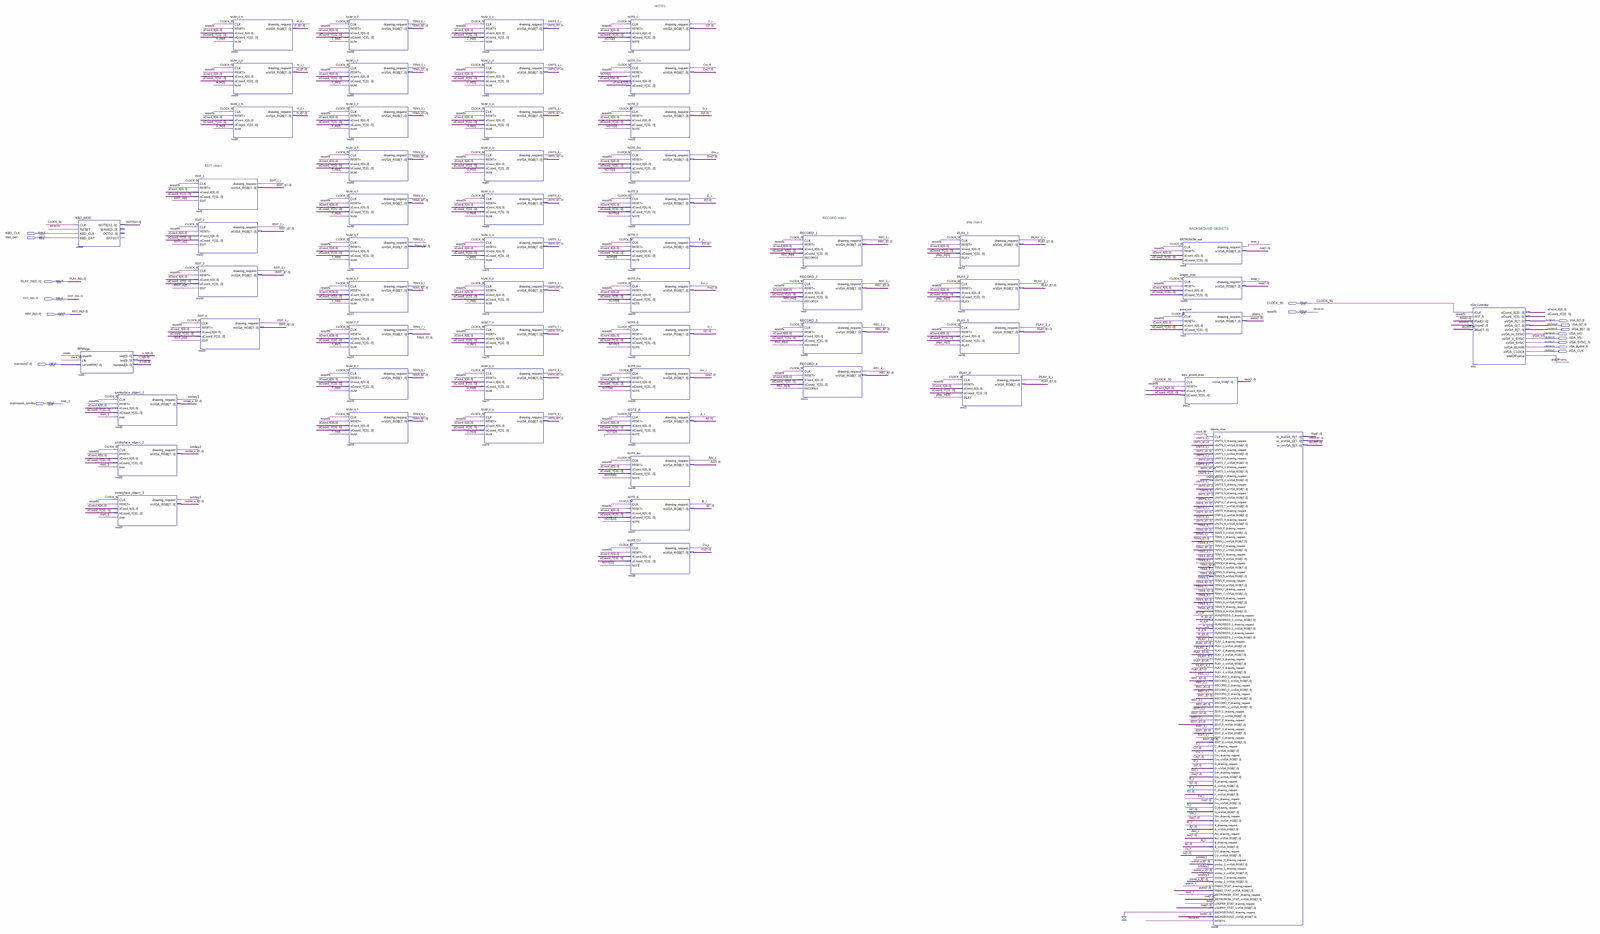
[diagram p0: schematic sheet, whole]
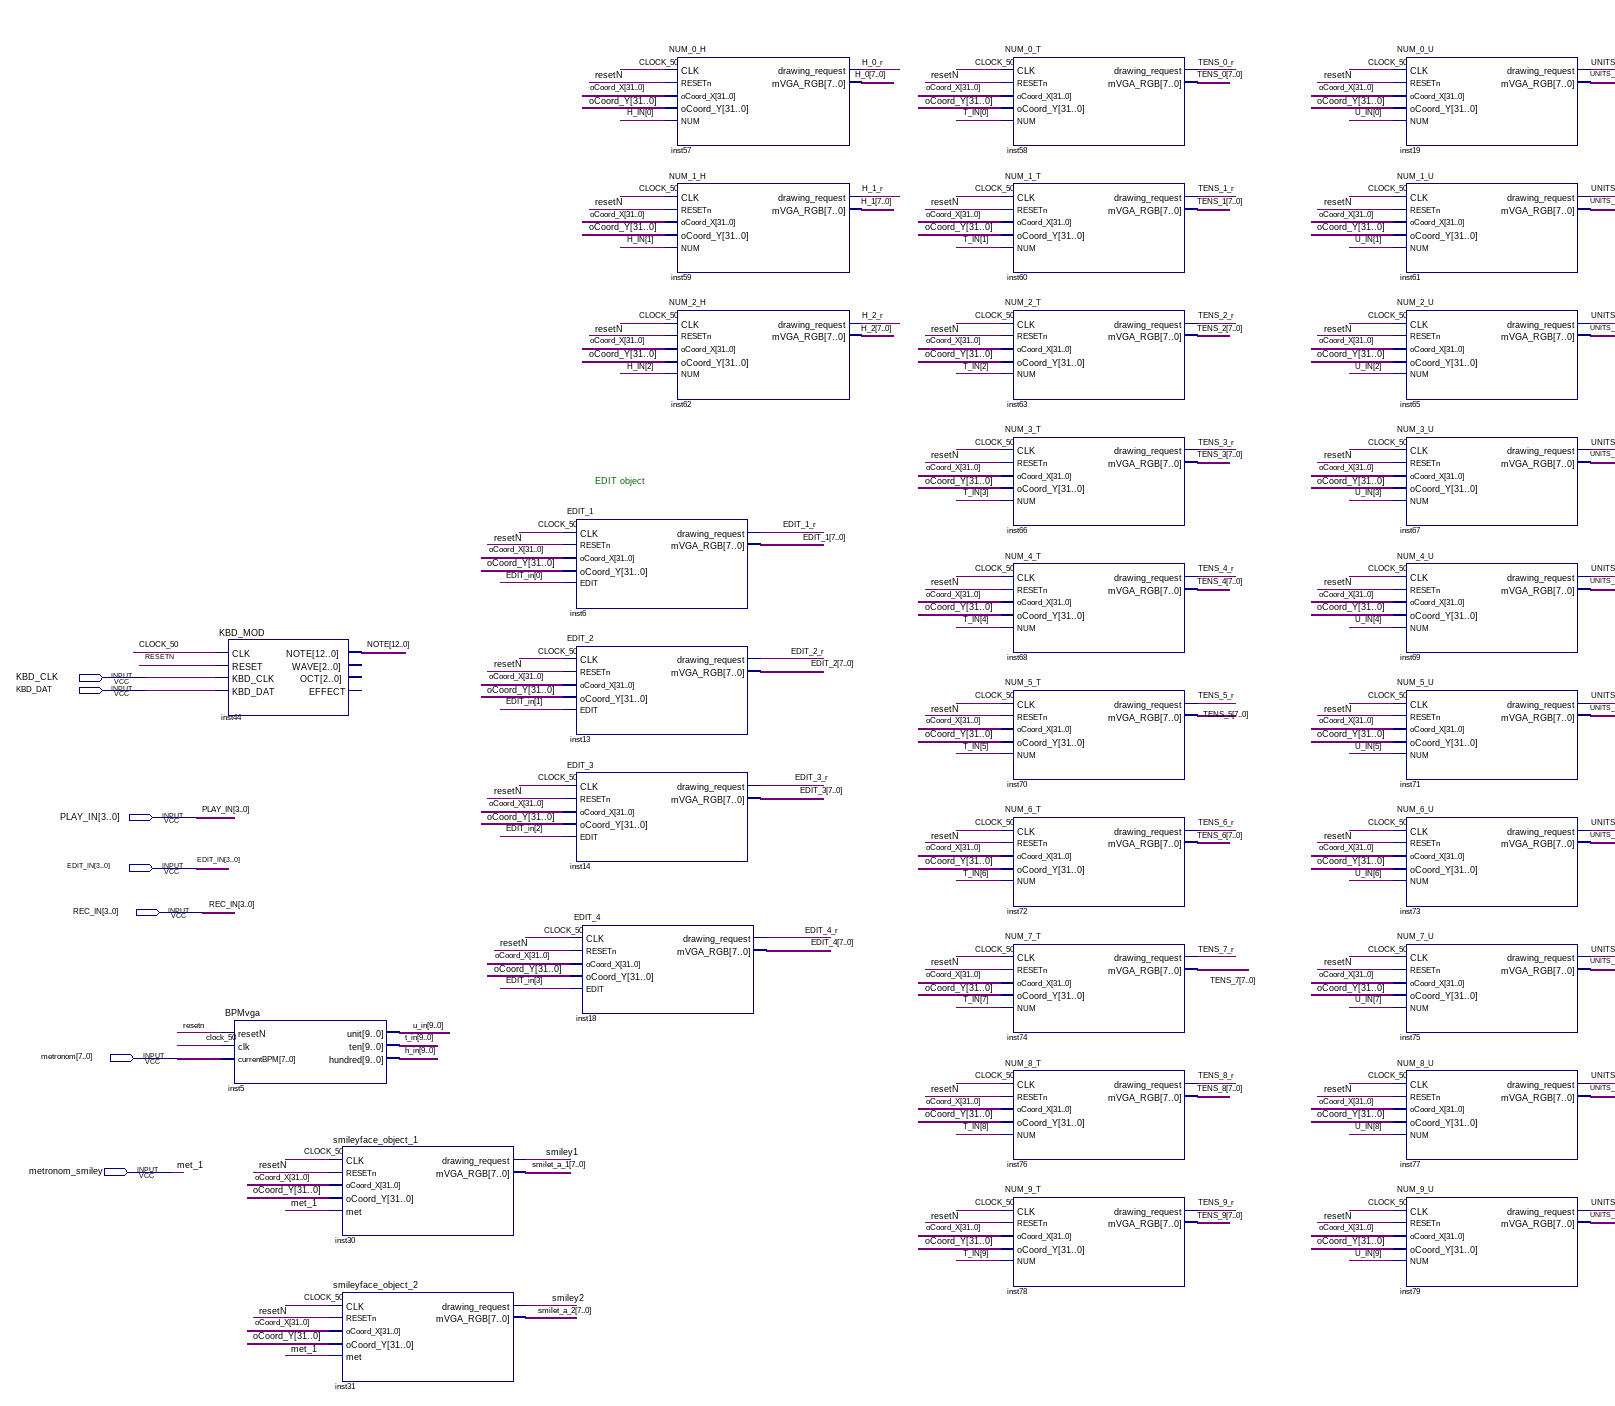
[diagram p1: schematic sheet, upper left part]
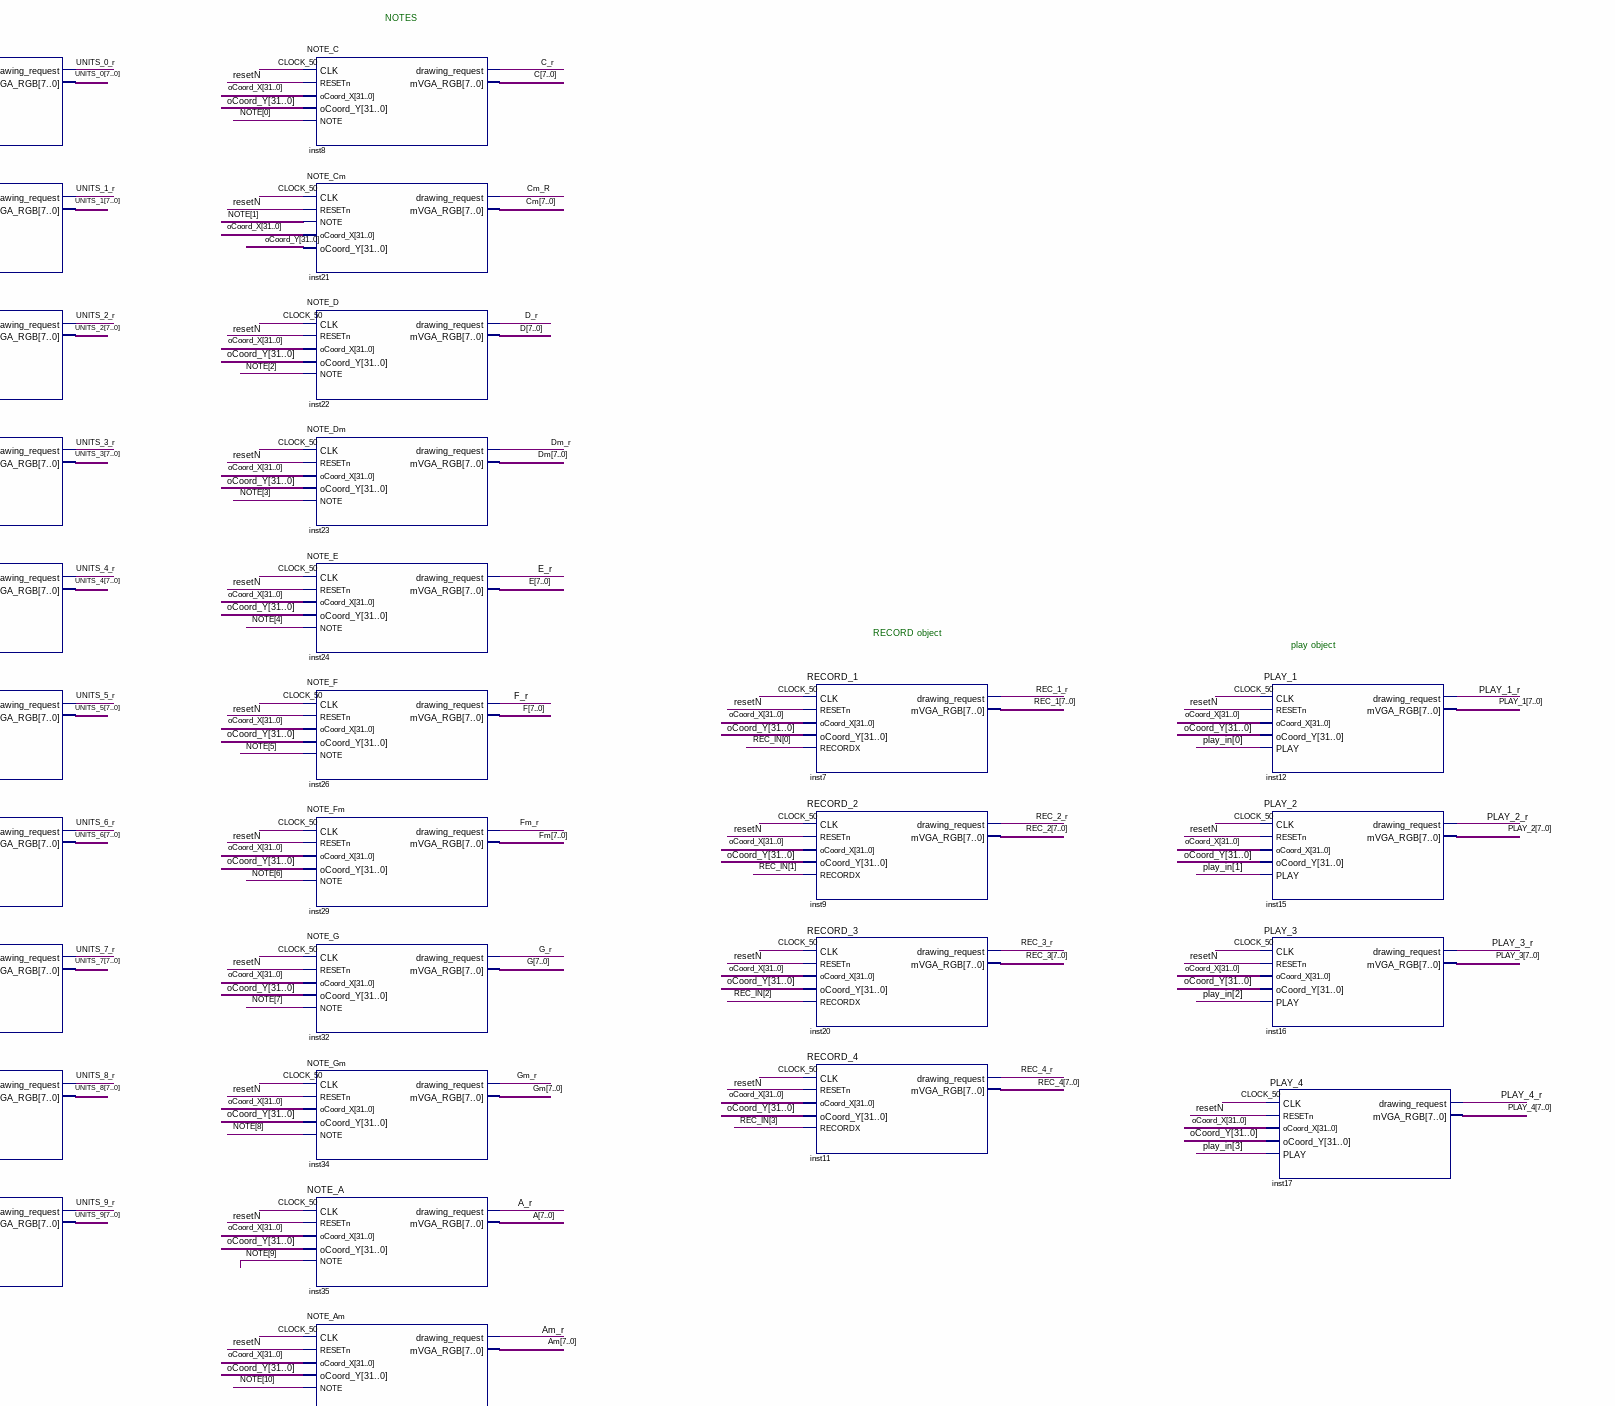
[diagram p2: schematic sheet, upper centre part]
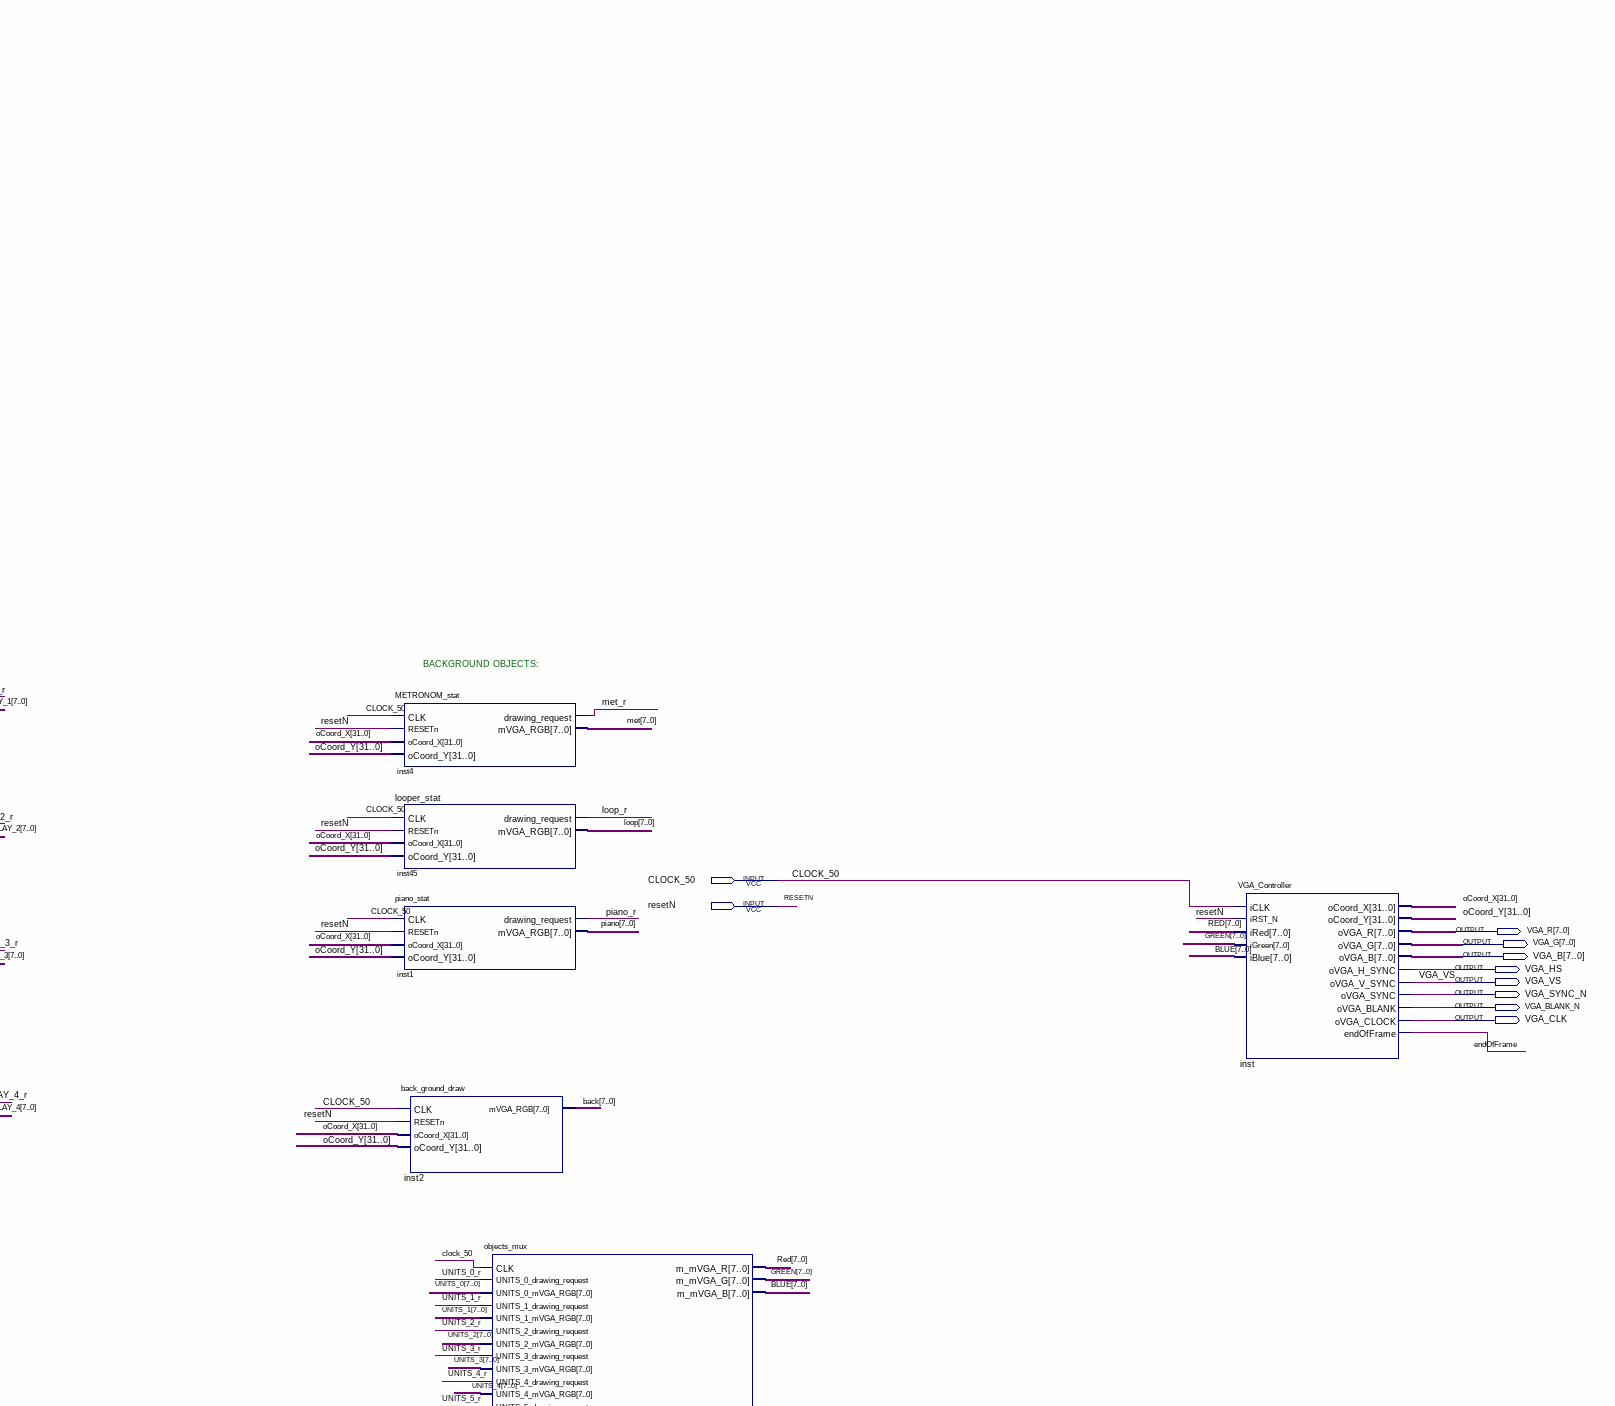
[diagram p3: schematic sheet, upper right part]
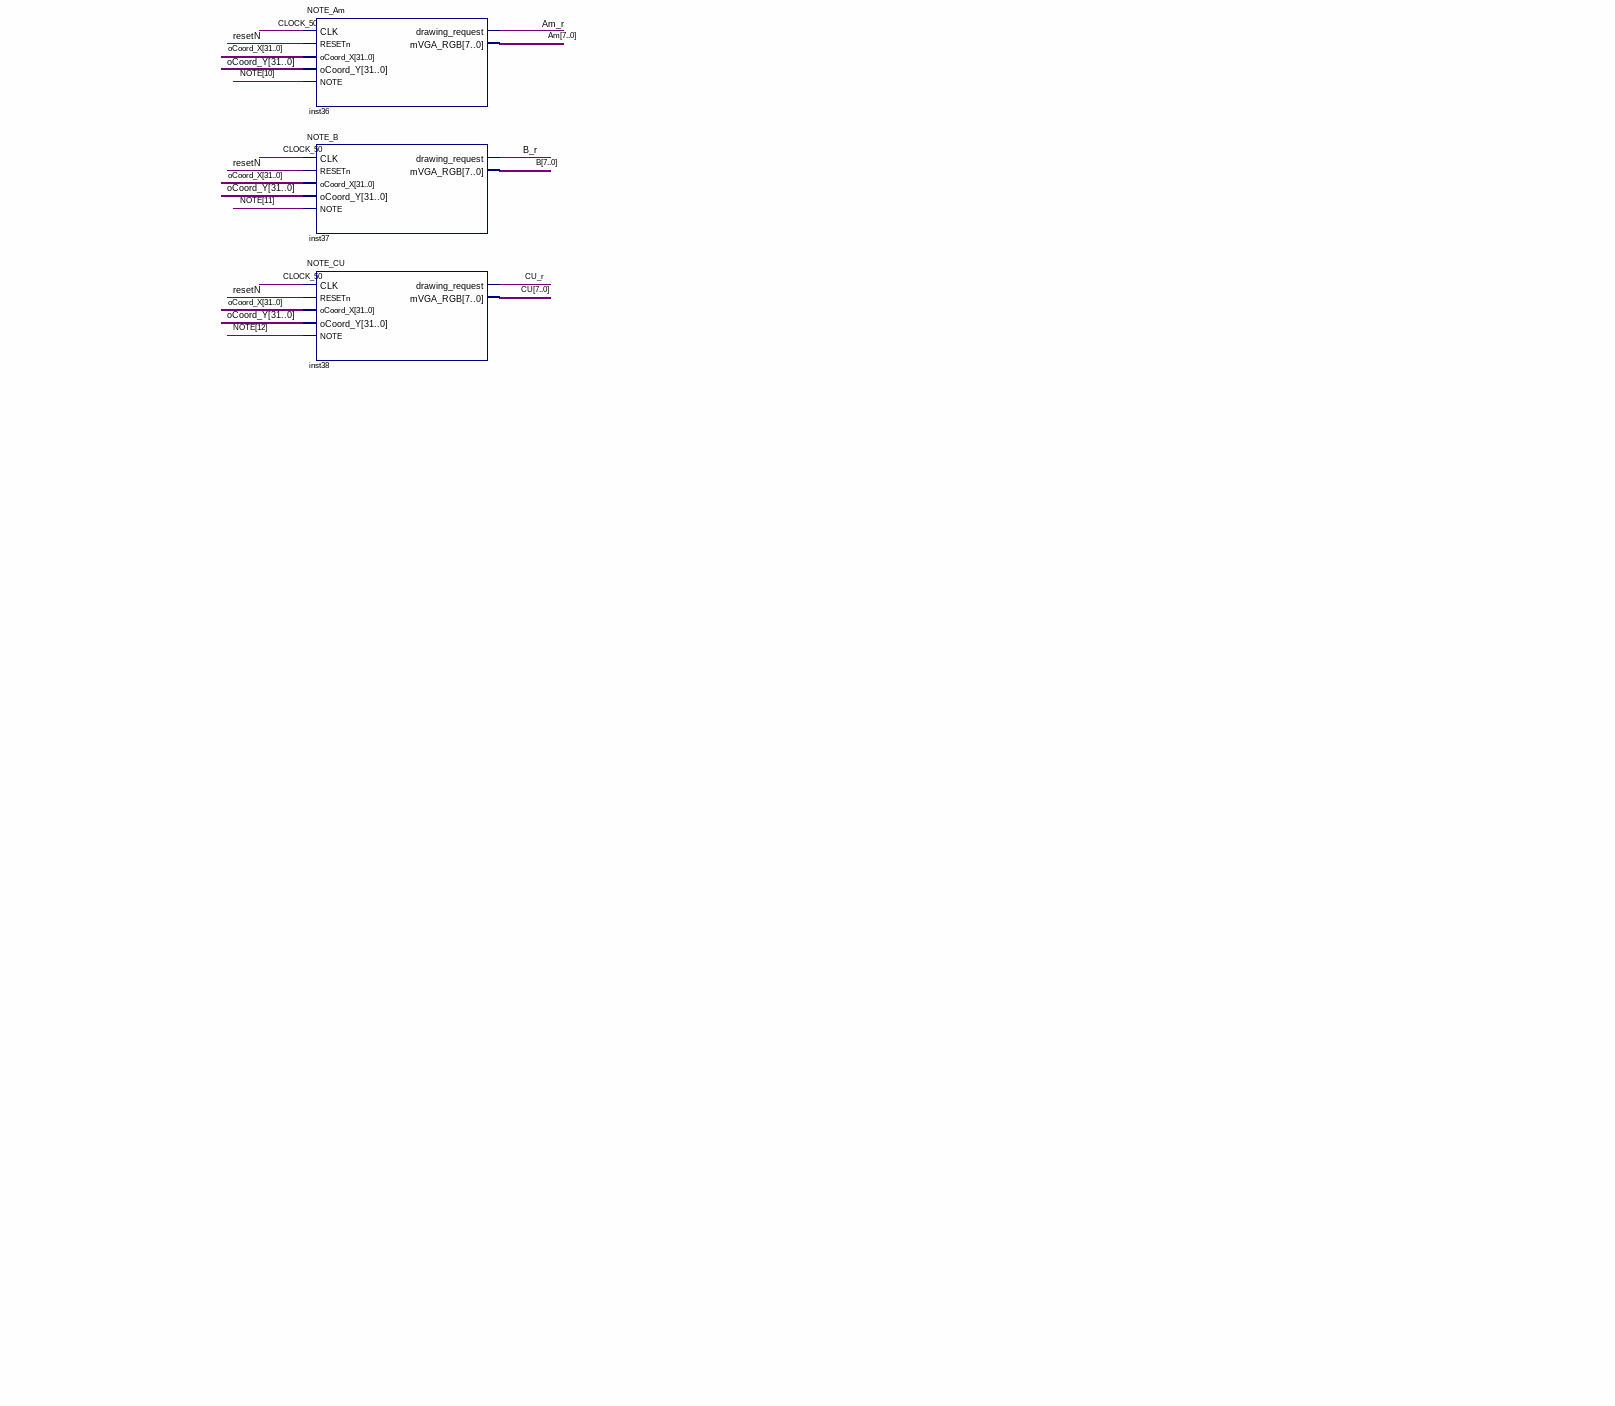
[diagram p4: schematic sheet, lower centre part]
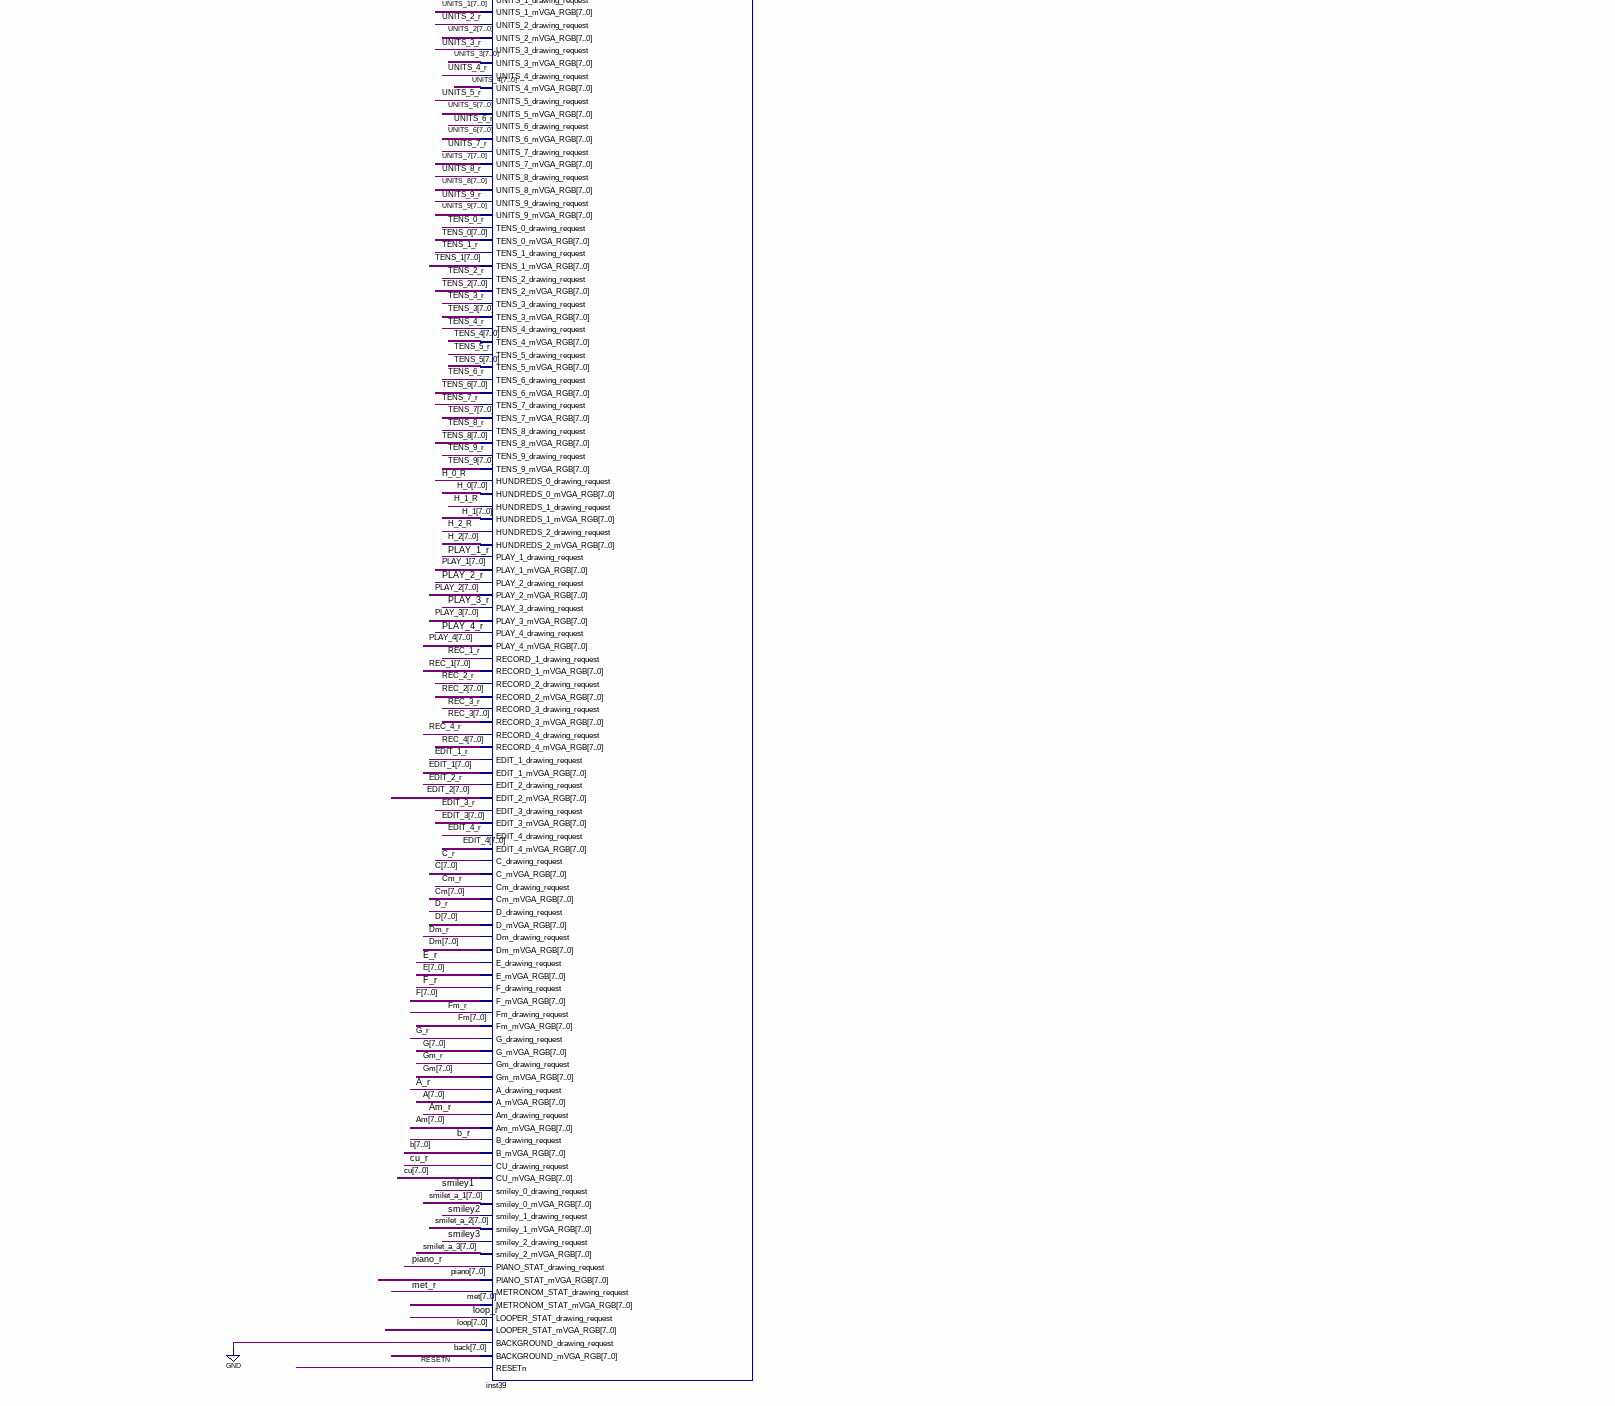
[diagram p5: schematic sheet, lower right part]
// Quartus schematic TOP_SIFTACH.bdf as structural Verilog: 59 symbols, 17 pins
module TOP_SIFTACH (
  input  KBD_CLK,
  input  KBD_DAT,
  input  [3:0] PLAY_IN,
  input  [3:0] EDIT_IN,
  input  CLOCK_50,
  input  resetN,
  input  [3:0] REC_IN,
  input  [7:0] metronom,
  input  metronom_smiley,
  output [7:0] VGA_R,
  output [7:0] VGA_G,
  output [7:0] VGA_B,
  output VGA_HS,
  output VGA_VS,
  output VGA_SYNC_N,
  output VGA_BLANK_N,
  output VGA_CLK
);

  wire A_r, Am_r, B_r, C_r, Cm_R, CU_r, D_r, Dm_r, E_r, EDIT_1_r, EDIT_2_r, EDIT_3_r, EDIT_4_r, endOfFrame,
       F_r, Fm_r, G_r, Gm_r, H_0_R, H_1_R, H_2_R, loop_r, met_r, piano_r, PLAY_1_r, PLAY_2_r, PLAY_3_r,
       PLAY_4_r, REC_1_r, REC_2_r, REC_3_r, REC_4_r, smiley1, smiley2, smiley3, TENS_0_r, TENS_1_r, TENS_2_r,
       TENS_3_r, TENS_4_r, TENS_5_r, TENS_6_r, TENS_7_r, TENS_8_r, TENS_9_r, UNITS_0_r, UNITS_1_r, UNITS_2_r,
       UNITS_3_r, UNITS_4_r, UNITS_5_r, UNITS_6_r, UNITS_7_r, UNITS_8_r, UNITS_9_r;
  wire [7:0] A, Am, B, back, BLUE, C, Cm, CU, D, Dm, E, EDIT_1, EDIT_2, EDIT_3, EDIT_4, F, Fm, G, Gm, GREEN,
       H_0, H_1, H_2, loop, met, piano, PLAY_1, PLAY_2, PLAY_3, PLAY_4, REC_1, REC_2, REC_3, REC_4, RED,
       smilet_a_1, smilet_a_2, smilet_a_3, TENS_0, TENS_1, TENS_2, TENS_3, TENS_4, TENS_5, TENS_6, TENS_7,
       TENS_8, TENS_9, UNITS_0, UNITS_1, UNITS_2, UNITS_3, UNITS_4, UNITS_5, UNITS_6, UNITS_7, UNITS_8,
       UNITS_9;
  wire [9:0] H_IN, T_IN, U_IN;
  wire [12:0] NOTE;
  wire [31:0] oCoord_X, oCoord_Y;

  KBD_MOD inst44 (
    .CLK(CLOCK_50), .RESET(resetN), .KBD_CLK(KBD_CLK), .KBD_DAT(KBD_DAT), .NOTE(NOTE));  // open: WAVE, OCT, EFFECT
  BPMvga inst5 (.resetN(resetN), .clk(CLOCK_50), .currentBPM(metronom), .unit(U_IN), .ten(T_IN), .hundred(H_IN));
  smileyface_object_1 inst30 (
    .CLK(CLOCK_50), .RESETn(resetN), .oCoord_X(oCoord_X), .oCoord_Y(oCoord_Y), .met(metronom_smiley),
    .drawing_request(smiley1), .mVGA_RGB(smilet_a_1));
  smileyface_object_2 inst31 (
    .CLK(CLOCK_50), .RESETn(resetN), .oCoord_X(oCoord_X), .oCoord_Y(oCoord_Y), .met(metronom_smiley),
    .drawing_request(smiley2), .mVGA_RGB(smilet_a_2));
  smileyface_object_3 inst33 (
    .CLK(CLOCK_50), .RESETn(resetN), .oCoord_X(oCoord_X), .oCoord_Y(oCoord_Y), .met(metronom_smiley),
    .drawing_request(smiley3), .mVGA_RGB(smilet_a_3));
  EDIT_1 inst6 (
    .CLK(CLOCK_50), .RESETn(resetN), .oCoord_X(oCoord_X), .oCoord_Y(oCoord_Y), .EDIT(EDIT_IN[0]),
    .drawing_request(EDIT_1_r), .mVGA_RGB(EDIT_1));
  EDIT_2 inst13 (
    .CLK(CLOCK_50), .RESETn(resetN), .oCoord_X(oCoord_X), .oCoord_Y(oCoord_Y), .EDIT(EDIT_IN[1]),
    .drawing_request(EDIT_2_r), .mVGA_RGB(EDIT_2));
  EDIT_3 inst14 (
    .CLK(CLOCK_50), .RESETn(resetN), .oCoord_X(oCoord_X), .oCoord_Y(oCoord_Y), .EDIT(EDIT_IN[2]),
    .drawing_request(EDIT_3_r), .mVGA_RGB(EDIT_3));
  EDIT_4 inst18 (
    .CLK(CLOCK_50), .RESETn(resetN), .oCoord_X(oCoord_X), .oCoord_Y(oCoord_Y), .EDIT(EDIT_IN[3]),
    .drawing_request(EDIT_4_r), .mVGA_RGB(EDIT_4));
  NUM_0_H inst57 (
    .CLK(CLOCK_50), .RESETn(resetN), .oCoord_X(oCoord_X), .oCoord_Y(oCoord_Y), .NUM(H_IN[0]),
    .drawing_request(H_0_R), .mVGA_RGB(H_0));
  NUM_1_H inst59 (
    .CLK(CLOCK_50), .RESETn(resetN), .oCoord_X(oCoord_X), .oCoord_Y(oCoord_Y), .NUM(H_IN[1]),
    .drawing_request(H_1_R), .mVGA_RGB(H_1));
  NUM_2_H inst62 (
    .CLK(CLOCK_50), .RESETn(resetN), .oCoord_X(oCoord_X), .oCoord_Y(oCoord_Y), .NUM(H_IN[2]),
    .drawing_request(H_2_R), .mVGA_RGB(H_2));
  NUM_0_T inst58 (
    .CLK(CLOCK_50), .RESETn(resetN), .oCoord_X(oCoord_X), .oCoord_Y(oCoord_Y), .NUM(T_IN[0]),
    .drawing_request(TENS_0_r), .mVGA_RGB(TENS_0));
  NUM_1_T inst60 (
    .CLK(CLOCK_50), .RESETn(resetN), .oCoord_X(oCoord_X), .oCoord_Y(oCoord_Y), .NUM(T_IN[1]),
    .drawing_request(TENS_1_r), .mVGA_RGB(TENS_1));
  NUM_2_T inst63 (
    .CLK(CLOCK_50), .RESETn(resetN), .oCoord_X(oCoord_X), .oCoord_Y(oCoord_Y), .NUM(T_IN[2]),
    .drawing_request(TENS_2_r), .mVGA_RGB(TENS_2));
  NUM_3_T inst66 (
    .CLK(CLOCK_50), .RESETn(resetN), .oCoord_X(oCoord_X), .oCoord_Y(oCoord_Y), .NUM(T_IN[3]),
    .drawing_request(TENS_3_r), .mVGA_RGB(TENS_3));
  NUM_4_T inst68 (
    .CLK(CLOCK_50), .RESETn(resetN), .oCoord_X(oCoord_X), .oCoord_Y(oCoord_Y), .NUM(T_IN[4]),
    .drawing_request(TENS_4_r), .mVGA_RGB(TENS_4));
  NUM_5_T inst70 (
    .CLK(CLOCK_50), .RESETn(resetN), .oCoord_X(oCoord_X), .oCoord_Y(oCoord_Y), .NUM(T_IN[5]),
    .drawing_request(TENS_5_r), .mVGA_RGB(TENS_5));
  NUM_6_T inst72 (
    .CLK(CLOCK_50), .RESETn(resetN), .oCoord_X(oCoord_X), .oCoord_Y(oCoord_Y), .NUM(T_IN[6]),
    .drawing_request(TENS_6_r), .mVGA_RGB(TENS_6));
  NUM_7_T inst74 (
    .CLK(CLOCK_50), .RESETn(resetN), .oCoord_X(oCoord_X), .oCoord_Y(oCoord_Y), .NUM(T_IN[7]),
    .drawing_request(TENS_7_r), .mVGA_RGB(TENS_7));
  NUM_8_T inst76 (
    .CLK(CLOCK_50), .RESETn(resetN), .oCoord_X(oCoord_X), .oCoord_Y(oCoord_Y), .NUM(T_IN[8]),
    .drawing_request(TENS_8_r), .mVGA_RGB(TENS_8));
  NUM_9_T inst78 (
    .CLK(CLOCK_50), .RESETn(resetN), .oCoord_X(oCoord_X), .oCoord_Y(oCoord_Y), .NUM(T_IN[9]),
    .drawing_request(TENS_9_r), .mVGA_RGB(TENS_9));
  NUM_0_U inst19 (
    .CLK(CLOCK_50), .RESETn(resetN), .oCoord_X(oCoord_X), .oCoord_Y(oCoord_Y), .NUM(U_IN[0]),
    .drawing_request(UNITS_0_r), .mVGA_RGB(UNITS_0));
  NUM_1_U inst61 (
    .CLK(CLOCK_50), .RESETn(resetN), .oCoord_X(oCoord_X), .oCoord_Y(oCoord_Y), .NUM(U_IN[1]),
    .drawing_request(UNITS_1_r), .mVGA_RGB(UNITS_1));
  NUM_2_U inst65 (
    .CLK(CLOCK_50), .RESETn(resetN), .oCoord_X(oCoord_X), .oCoord_Y(oCoord_Y), .NUM(U_IN[2]),
    .drawing_request(UNITS_2_r), .mVGA_RGB(UNITS_2));
  NUM_3_U inst67 (
    .CLK(CLOCK_50), .RESETn(resetN), .oCoord_X(oCoord_X), .oCoord_Y(oCoord_Y), .NUM(U_IN[3]),
    .drawing_request(UNITS_3_r), .mVGA_RGB(UNITS_3));
  NUM_4_U inst69 (
    .CLK(CLOCK_50), .RESETn(resetN), .oCoord_X(oCoord_X), .oCoord_Y(oCoord_Y), .NUM(U_IN[4]),
    .drawing_request(UNITS_4_r), .mVGA_RGB(UNITS_4));
  NUM_5_U inst71 (
    .CLK(CLOCK_50), .RESETn(resetN), .oCoord_X(oCoord_X), .oCoord_Y(oCoord_Y), .NUM(U_IN[5]),
    .drawing_request(UNITS_5_r), .mVGA_RGB(UNITS_5));
  NUM_6_U inst73 (
    .CLK(CLOCK_50), .RESETn(resetN), .oCoord_X(oCoord_X), .oCoord_Y(oCoord_Y), .NUM(U_IN[6]),
    .drawing_request(UNITS_6_r), .mVGA_RGB(UNITS_6));
  NUM_7_U inst75 (
    .CLK(CLOCK_50), .RESETn(resetN), .oCoord_X(oCoord_X), .oCoord_Y(oCoord_Y), .NUM(U_IN[7]),
    .drawing_request(UNITS_7_r), .mVGA_RGB(UNITS_7));
  NUM_8_U inst77 (
    .CLK(CLOCK_50), .RESETn(resetN), .oCoord_X(oCoord_X), .oCoord_Y(oCoord_Y), .NUM(U_IN[8]),
    .drawing_request(UNITS_8_r), .mVGA_RGB(UNITS_8));
  NUM_9_U inst79 (
    .CLK(CLOCK_50), .RESETn(resetN), .oCoord_X(oCoord_X), .oCoord_Y(oCoord_Y), .NUM(U_IN[9]),
    .drawing_request(UNITS_9_r), .mVGA_RGB(UNITS_9));
  NOTE_C inst8 (
    .CLK(CLOCK_50), .RESETn(resetN), .oCoord_X(oCoord_X), .oCoord_Y(oCoord_Y), .NOTE(NOTE[0]),
    .drawing_request(C_r), .mVGA_RGB(C));
  NOTE_Cm inst21 (
    .CLK(CLOCK_50), .RESETn(resetN), .NOTE(NOTE[1]), .oCoord_X(oCoord_X), .oCoord_Y(oCoord_Y),
    .drawing_request(Cm_R), .mVGA_RGB(Cm));
  NOTE_D inst22 (
    .CLK(CLOCK_50), .RESETn(resetN), .oCoord_X(oCoord_X), .oCoord_Y(oCoord_Y), .NOTE(NOTE[2]),
    .drawing_request(D_r), .mVGA_RGB(D));
  NOTE_Dm inst23 (
    .CLK(CLOCK_50), .RESETn(resetN), .oCoord_X(oCoord_X), .oCoord_Y(oCoord_Y), .NOTE(NOTE[3]),
    .drawing_request(Dm_r), .mVGA_RGB(Dm));
  NOTE_E inst24 (
    .CLK(CLOCK_50), .RESETn(resetN), .oCoord_X(oCoord_X), .oCoord_Y(oCoord_Y), .NOTE(NOTE[4]),
    .drawing_request(E_r), .mVGA_RGB(E));
  NOTE_F inst26 (
    .CLK(CLOCK_50), .RESETn(resetN), .oCoord_X(oCoord_X), .oCoord_Y(oCoord_Y), .NOTE(NOTE[5]),
    .drawing_request(F_r), .mVGA_RGB(F));
  NOTE_Fm inst29 (
    .CLK(CLOCK_50), .RESETn(resetN), .oCoord_X(oCoord_X), .oCoord_Y(oCoord_Y), .NOTE(NOTE[6]),
    .drawing_request(Fm_r), .mVGA_RGB(Fm));
  NOTE_G inst32 (
    .CLK(CLOCK_50), .RESETn(resetN), .oCoord_X(oCoord_X), .oCoord_Y(oCoord_Y), .NOTE(NOTE[7]),
    .drawing_request(G_r), .mVGA_RGB(G));
  NOTE_Gm inst34 (
    .CLK(CLOCK_50), .RESETn(resetN), .oCoord_X(oCoord_X), .oCoord_Y(oCoord_Y), .NOTE(NOTE[8]),
    .drawing_request(Gm_r), .mVGA_RGB(Gm));
  NOTE_A inst35 (
    .CLK(CLOCK_50), .RESETn(resetN), .oCoord_X(oCoord_X), .oCoord_Y(oCoord_Y), .NOTE(NOTE[9]),
    .drawing_request(A_r), .mVGA_RGB(A));
  NOTE_Am inst36 (
    .CLK(CLOCK_50), .RESETn(resetN), .oCoord_X(oCoord_X), .oCoord_Y(oCoord_Y), .NOTE(NOTE[10]),
    .drawing_request(Am_r), .mVGA_RGB(Am));
  NOTE_B inst37 (
    .CLK(CLOCK_50), .RESETn(resetN), .oCoord_X(oCoord_X), .oCoord_Y(oCoord_Y), .NOTE(NOTE[11]),
    .drawing_request(B_r), .mVGA_RGB(B));
  NOTE_CU inst38 (
    .CLK(CLOCK_50), .RESETn(resetN), .oCoord_X(oCoord_X), .oCoord_Y(oCoord_Y), .NOTE(NOTE[12]),
    .drawing_request(CU_r), .mVGA_RGB(CU));
  RECORD_1 inst7 (
    .CLK(CLOCK_50), .RESETn(resetN), .oCoord_X(oCoord_X), .oCoord_Y(oCoord_Y), .RECORDX(REC_IN[0]),
    .drawing_request(REC_1_r), .mVGA_RGB(REC_1));
  RECORD_2 inst9 (
    .CLK(CLOCK_50), .RESETn(resetN), .oCoord_X(oCoord_X), .oCoord_Y(oCoord_Y), .RECORDX(REC_IN[1]),
    .drawing_request(REC_2_r), .mVGA_RGB(REC_2));
  RECORD_3 inst20 (
    .CLK(CLOCK_50), .RESETn(resetN), .oCoord_X(oCoord_X), .oCoord_Y(oCoord_Y), .RECORDX(REC_IN[2]),
    .drawing_request(REC_3_r), .mVGA_RGB(REC_3));
  RECORD_4 inst11 (
    .CLK(CLOCK_50), .RESETn(resetN), .oCoord_X(oCoord_X), .oCoord_Y(oCoord_Y), .RECORDX(REC_IN[3]),
    .drawing_request(REC_4_r), .mVGA_RGB(REC_4));
  PLAY_1 inst12 (
    .CLK(CLOCK_50), .RESETn(resetN), .oCoord_X(oCoord_X), .oCoord_Y(oCoord_Y), .PLAY(PLAY_IN[0]),
    .drawing_request(PLAY_1_r), .mVGA_RGB(PLAY_1));
  PLAY_2 inst15 (
    .CLK(CLOCK_50), .RESETn(resetN), .oCoord_X(oCoord_X), .oCoord_Y(oCoord_Y), .PLAY(PLAY_IN[1]),
    .drawing_request(PLAY_2_r), .mVGA_RGB(PLAY_2));
  PLAY_3 inst16 (
    .CLK(CLOCK_50), .RESETn(resetN), .oCoord_X(oCoord_X), .oCoord_Y(oCoord_Y), .PLAY(PLAY_IN[2]),
    .drawing_request(PLAY_3_r), .mVGA_RGB(PLAY_3));
  PLAY_4 inst17 (
    .CLK(CLOCK_50), .RESETn(resetN), .oCoord_X(oCoord_X), .oCoord_Y(oCoord_Y), .PLAY(PLAY_IN[3]),
    .drawing_request(PLAY_4_r), .mVGA_RGB(PLAY_4));
  METRONOM_stat inst4 (
    .CLK(CLOCK_50), .RESETn(resetN), .oCoord_X(oCoord_X), .oCoord_Y(oCoord_Y), .drawing_request(met_r),
    .mVGA_RGB(met));
  looper_stat inst45 (
    .CLK(CLOCK_50), .RESETn(resetN), .oCoord_X(oCoord_X), .oCoord_Y(oCoord_Y), .drawing_request(loop_r),
    .mVGA_RGB(loop));
  piano_stat inst1 (
    .CLK(CLOCK_50), .RESETn(resetN), .oCoord_X(oCoord_X), .oCoord_Y(oCoord_Y), .drawing_request(piano_r),
    .mVGA_RGB(piano));
  back_ground_draw inst2 (.CLK(CLOCK_50), .RESETn(resetN), .oCoord_X(oCoord_X), .oCoord_Y(oCoord_Y), .mVGA_RGB(back));
  objects_mux inst39 (
    .CLK(CLOCK_50), .UNITS_0_drawing_request(UNITS_0_r), .UNITS_0_mVGA_RGB(UNITS_0),
    .UNITS_1_drawing_request(UNITS_1_r), .UNITS_1_mVGA_RGB(UNITS_1), .UNITS_2_drawing_request(UNITS_2_r),
    .UNITS_2_mVGA_RGB(UNITS_2), .UNITS_3_drawing_request(UNITS_3_r), .UNITS_3_mVGA_RGB(UNITS_3),
    .UNITS_4_drawing_request(UNITS_4_r), .UNITS_4_mVGA_RGB(UNITS_4), .UNITS_5_drawing_request(UNITS_5_r),
    .UNITS_5_mVGA_RGB(UNITS_5), .UNITS_6_drawing_request(UNITS_6_r), .UNITS_6_mVGA_RGB(UNITS_6),
    .UNITS_7_drawing_request(UNITS_7_r), .UNITS_7_mVGA_RGB(UNITS_7), .UNITS_8_drawing_request(UNITS_8_r),
    .UNITS_8_mVGA_RGB(UNITS_8), .UNITS_9_drawing_request(UNITS_9_r), .UNITS_9_mVGA_RGB(UNITS_9),
    .TENS_0_drawing_request(TENS_0_r), .TENS_0_mVGA_RGB(TENS_0), .TENS_1_drawing_request(TENS_1_r),
    .TENS_1_mVGA_RGB(TENS_1), .TENS_2_drawing_request(TENS_2_r), .TENS_2_mVGA_RGB(TENS_2),
    .TENS_3_drawing_request(TENS_3_r), .TENS_3_mVGA_RGB(TENS_3), .TENS_4_drawing_request(TENS_4_r),
    .TENS_4_mVGA_RGB(TENS_4), .TENS_5_drawing_request(TENS_5_r), .TENS_5_mVGA_RGB(TENS_5),
    .TENS_6_drawing_request(TENS_6_r), .TENS_6_mVGA_RGB(TENS_6), .TENS_7_drawing_request(TENS_7_r),
    .TENS_7_mVGA_RGB(TENS_7), .TENS_8_drawing_request(TENS_8_r), .TENS_8_mVGA_RGB(TENS_8),
    .TENS_9_drawing_request(TENS_9_r), .TENS_9_mVGA_RGB(TENS_9), .HUNDREDS_0_drawing_request(H_0_R),
    .HUNDREDS_0_mVGA_RGB(H_0), .HUNDREDS_1_drawing_request(H_1_R), .HUNDREDS_1_mVGA_RGB(H_1),
    .HUNDREDS_2_drawing_request(H_2_R), .HUNDREDS_2_mVGA_RGB(H_2), .PLAY_1_drawing_request(PLAY_1_r),
    .PLAY_1_mVGA_RGB(PLAY_1), .PLAY_2_drawing_request(PLAY_2_r), .PLAY_2_mVGA_RGB(PLAY_2),
    .PLAY_3_drawing_request(PLAY_3_r), .PLAY_3_mVGA_RGB(PLAY_3), .PLAY_4_drawing_request(PLAY_4_r),
    .PLAY_4_mVGA_RGB(PLAY_4), .RECORD_1_drawing_request(REC_1_r), .RECORD_1_mVGA_RGB(REC_1),
    .RECORD_2_drawing_request(REC_2_r), .RECORD_2_mVGA_RGB(REC_2), .RECORD_3_drawing_request(REC_3_r),
    .RECORD_3_mVGA_RGB(REC_3), .RECORD_4_drawing_request(REC_4_r), .RECORD_4_mVGA_RGB(REC_4),
    .EDIT_1_drawing_request(EDIT_1_r), .EDIT_1_mVGA_RGB(EDIT_1), .EDIT_2_drawing_request(EDIT_2_r),
    .EDIT_2_mVGA_RGB(EDIT_2), .EDIT_3_drawing_request(EDIT_3_r), .EDIT_3_mVGA_RGB(EDIT_3),
    .EDIT_4_drawing_request(EDIT_4_r), .EDIT_4_mVGA_RGB(EDIT_4), .C_drawing_request(C_r), .C_mVGA_RGB(C),
    .Cm_drawing_request(Cm_R), .Cm_mVGA_RGB(Cm), .D_drawing_request(D_r), .D_mVGA_RGB(D),
    .Dm_drawing_request(Dm_r), .Dm_mVGA_RGB(Dm), .E_drawing_request(E_r), .E_mVGA_RGB(E),
    .F_drawing_request(F_r), .F_mVGA_RGB(F), .Fm_drawing_request(Fm_r), .Fm_mVGA_RGB(Fm),
    .G_drawing_request(G_r), .G_mVGA_RGB(G), .Gm_drawing_request(Gm_r), .Gm_mVGA_RGB(Gm),
    .A_drawing_request(A_r), .A_mVGA_RGB(A), .Am_drawing_request(Am_r), .Am_mVGA_RGB(Am),
    .B_drawing_request(B_r), .B_mVGA_RGB(B), .CU_drawing_request(CU_r), .CU_mVGA_RGB(CU),
    .smiley_0_drawing_request(smiley1), .smiley_0_mVGA_RGB(smilet_a_1), .smiley_1_drawing_request(smiley2),
    .smiley_1_mVGA_RGB(smilet_a_2), .smiley_2_drawing_request(smiley3), .smiley_2_mVGA_RGB(smilet_a_3),
    .PIANO_STAT_drawing_request(piano_r), .PIANO_STAT_mVGA_RGB(piano), .METRONOM_STAT_drawing_request(met_r),
    .METRONOM_STAT_mVGA_RGB(met), .LOOPER_STAT_drawing_request(loop_r), .LOOPER_STAT_mVGA_RGB(loop),
    .BACKGROUND_drawing_request(1'b0), .BACKGROUND_mVGA_RGB(back), .RESETn(resetN), .m_mVGA_R(RED),
    .m_mVGA_G(GREEN), .m_mVGA_B(BLUE));
  VGA_Controller inst (
    .iCLK(CLOCK_50), .iRST_N(resetN), .iRed(RED), .iGreen(GREEN), .iBlue(BLUE), .oCoord_X(oCoord_X),
    .oCoord_Y(oCoord_Y), .oVGA_R(VGA_R), .oVGA_G(VGA_G), .oVGA_B(VGA_B), .oVGA_H_SYNC(VGA_HS),
    .oVGA_V_SYNC(VGA_VS), .oVGA_SYNC(VGA_SYNC_N), .oVGA_BLANK(VGA_BLANK_N), .oVGA_CLOCK(VGA_CLK),
    .endOfFrame(endOfFrame));

  // Other names for the same wires on the sheet: met_1 = metronom_smiley

  // Notes on the sheet:
  //   NOTES
  //   EDIT object
  //   RECORD object
  //   play object
  //   BACKGROUND OBJECTS:
endmodule
